# EAGLE design eNode (EAGLE 7.2.0)
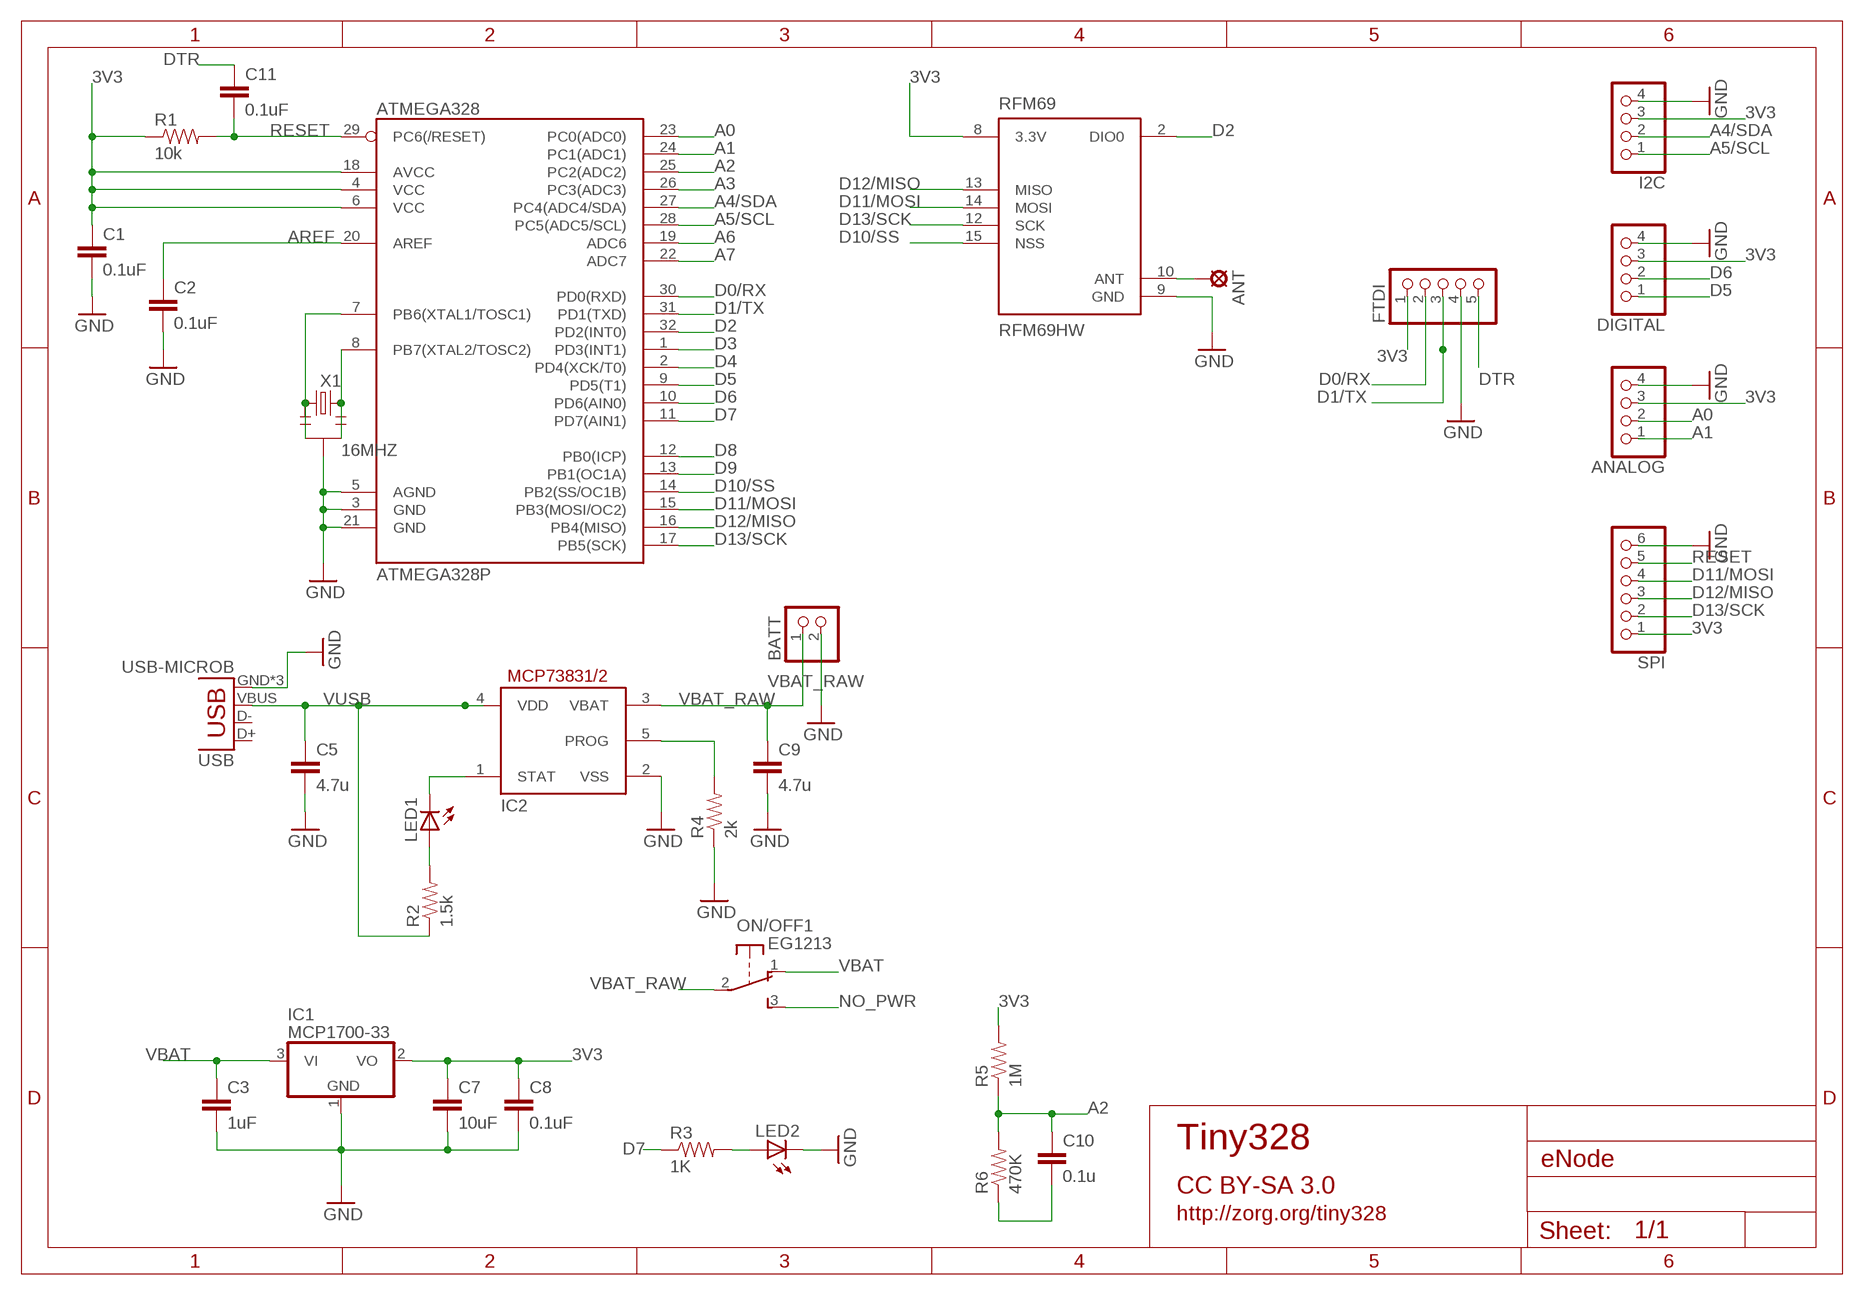
[diagram p0: schematic, sheet 1]

## Parts
ANALOG  PINHD-1X4  [1X04]
ANT  LSP10  [LSP10]
ATMEGA328P  ATMEGA328  ATMEGA168  [TQFP32-08]
BATT  PINHD-1X2  [1X02]
C1  0.1uF  CAP0603-CAP  [0603-CAP]
C2  0.1uF  CAP0603-CAP  [0603-CAP]
C3  1uF  CAP0603-CAP  [0603-CAP]
C5  4.7u  CAP0603-CAP  [0603-CAP]
C7  10uF  CAP0603-CAP  [0603-CAP]
C8  0.1uF  CAP0603-CAP  [0603-CAP]
C9  4.7u  CAP0603-CAP  [0603-CAP]
C10  0.1u  CAP0603-CAP  [0603-CAP]
C11  0.1uF  CAP0603-CAP  [0603-CAP]
DIGITAL  PINHD-1X4  [1X04]
FTDI  PINHD-1X5  [1X05]
I2C  PINHD-1X4  [1X04]
IC1  MCP1700-33  MCP1703CB  [SOT23]
IC2  MCP73831/OT  [SOT23-5L]
LED1  LEDCHIPLED_0603  [CHIPLED_0603]
LED2  LEDCHIPLED_0603  [CHIPLED_0603]
ON/OFF  EG1213  [EG1213]
R1  10k  RESISTOR0603-RES  [0603-RES]
R2  1.5k  RESISTOR0603-RES  [0603-RES]
R3  1K  RESISTOR0603-RES  [0603-RES]
R4  2k  RESISTOR0603-RES  [0603-RES]
R5  1M  RESISTOR0603-RES  [0603-RES]
R6  470K  RESISTOR0603-RES  [0603-RES]
RFM69  RFM69HW  [RFM69W-XXXS2]
SPI  PINHD-1X6  [1X06]
USB  USB-MICROB  [USB-MICROB]
X1  16MHZ  RESONATOR16MHZ  [RESONATOR-SMD]

## Nets
3V3: ANALOG.3 ATMEGA328P.4(VCC) ATMEGA328P.6(VCC) ATMEGA328P.18(AVCC) C1.1 C7.1 C8.1 DIGITAL.3 FTDI.1 I2C.3 IC1.2(VO) R1.1 R5.2 RFM69.8(3.3V) SPI.1
A0: ANALOG.2 ATMEGA328P.23(PC0(ADC0))
A1: ANALOG.1 ATMEGA328P.24(PC1(ADC1))
A2: ATMEGA328P.25(PC2(ADC2)) C10.1 R5.1 R6.2
A3: ATMEGA328P.26(PC3(ADC3))
A4/SDA: ATMEGA328P.27(PC4(ADC4/SDA)) I2C.2
A5/SCL: ATMEGA328P.28(PC5(ADC5/SCL)) I2C.1
A6: ATMEGA328P.19(ADC6)
A7: ATMEGA328P.22(ADC7)
ANT: ANT.MP RFM69.10(ANT)
AREF: ATMEGA328P.20(AREF) C2.1
D0/RX: ATMEGA328P.30(PD0(RXD)) FTDI.2
D1/TX: ATMEGA328P.31(PD1(TXD)) FTDI.3
D2: ATMEGA328P.32(PD2(INT0)) RFM69.2(DIO0)
D3: ATMEGA328P.1(PD3(INT1))
D4: ATMEGA328P.2(PD4(XCK/T0))
D5: ATMEGA328P.9(PD5(T1)) DIGITAL.1
D6: ATMEGA328P.10(PD6(AIN0)) DIGITAL.2
D7: ATMEGA328P.11(PD7(AIN1)) R3.1
D8: ATMEGA328P.12(PB0(ICP))
D9: ATMEGA328P.13(PB1(OC1A))
D10/SS: ATMEGA328P.14(PB2(SS/OC1B)) RFM69.15(NSS)
D11/MOSI: ATMEGA328P.15(PB3(MOSI/OC2)) RFM69.14(MOSI) SPI.4
D12/MISO: ATMEGA328P.16(PB4(MISO)) RFM69.13(MISO) SPI.3
D13/SCK: ATMEGA328P.17(PB5(SCK)) RFM69.12(SCK) SPI.2
DTR: C11.1 FTDI.5
GND: ANALOG.4 ATMEGA328P.3(GND) ATMEGA328P.5(AGND) ATMEGA328P.21(GND) BATT.2 C1.2 C2.2 C3.2 C5.2 C7.2 C8.2 C9.2 DIGITAL.4 FTDI.4 I2C.4 IC1.1(GND) IC2.2(VSS) LED2.C R4.1 RFM69.9(GND) SPI.6 USB.GND USB.MT1(GND) USB.MT2(GND) X1.2
N$1: LED1.A R2.2
N$3: ATMEGA328P.7(PB6(XTAL1/TOSC1)) X1.1
N$4: ATMEGA328P.8(PB7(XTAL2/TOSC2)) X1.3
N$6: C10.2 R6.1
N$8: LED2.A R3.2
NO_PWR: ON/OFF.3(1:S)
PROG: IC2.5(PROG) R4.2
RESET: ATMEGA328P.29(PC6(/RESET)) C11.2 R1.2 SPI.5
STAT: IC2.1(STAT) LED1.C
VBAT: C3.1 IC1.3(VI) ON/OFF.1(1:O)
VBAT_RAW: BATT.1 C9.1 IC2.3(VBAT) ON/OFF.2(1:P)
VUSB: C5.1 IC2.4(VDD) R2.1 USB.VBUS
Unconnected: ON/OFF.MT1(MT) ON/OFF.MT2(MT) USB.D+ USB.D-

## Notes on the sheet
- Tiny328
- CC BY-SA 3.0
- http://zorg.org/tiny328

## Library data of the parts
ANALOG DIGITAL I2C = pinhead:PINHD-1X4: PIN HEADER
ANT = solpad:LSP10: SOLDER PAD drill 1.0 mm, distributor Buerklin, 12H555
ATMEGA328P = SparkFun-DigitalIC:ATMEGA168: Atmel 32-pin 8-bit micro, 16k flash.
BATT = pinhead:PINHD-1X2: PIN HEADER
C1-C3 C5 C7-C11 = SparkFun-Passives:CAP: Capacitor Standard 0603 ceramic capacitor, and 0.1" leaded capacitor.
FTDI = pinhead:PINHD-1X5: PIN HEADER
IC1 = linear:MCP1703: 250 mA, 16V, Low Quiescent Current LDO Regulator Source: http://ww1.microchip.com/downloads/en/DeviceDoc/22049b.pdf
IC2 = adafruit:MCP73831: MCP73831/2 Miniature Single-Cell, Fully Integrated Li-Ion, Li-Polymer Charge Management Controllers. Nice and small simple lipoly charge controller, with adjustable current and status output (LED) http://www.ladyada.net/library/pcb/eaglelibrary.html
LED1 LED2 = adafruit:LED: LED OSRAM: - CHIPLED LG R971, LG N971, LY N971, LG Q971, LY Q971, LO R971, LY R971 LH N974, LH R974 LS Q976, LO Q976, LY Q976 LO Q996 - Hyper CHIPLED LW Q18S LB Q993, LB Q99A, LB R99A - SideLED LS A670, LO A670, LY A670, LG A670, LP A670 LB A673, LV A673, LT A673, LW A673 LH A674 LY A675 LS A676, LA A676, LO A676, LY A676, LW A676 LS A679, LY A679, LG A679 - Hyper Micro SIDELED® LS Y876, LA Y876, LO Y876, LY Y876 LT Y87S - SmartLED LW L88C, LW L88S LB L89C, LB L89S, LG L890 LS L89K, LO L89K, LY L89K LS L896, LA L896, LO L896, LY L896 - TOPLED LS T670, LO T670, LY T670, LG T670, LP T670 LSG T670, LSP T670, LSY T670, LOP T670, LYG T670 LG T671, LOG T671, LSG T671 LB T673, LV T673, LT T673, LW T673 LH T674 LS T676, LA T676, LO T676, LY T676, LB T676, LH T676, LSB T676, LW T676 LB T67C, LV T67C, LT T67C, LS T67K, LO T67K, LY T67K, LW E67C LS E67B, LA E67B, LO E67B, LY E67B, LB E67C, LV E67C, LT E67C LW T67C LS T679, LY T679, LG T679 LS T770, LO T770, LY T770, LG T770, LP T770 LB T773, LV T773, LT T773, LW T773 LH T774 LS E675, LA E675, LY E675, LS T675 LS T776, LA T776, LO T776, LY T776, LB T776 LHGB T686 LT T68C, LB T68C - Hyper Mini TOPLED® LB M676 - Mini TOPLED Santana® LG M470 LS M47K, LO M47K, LY M47K Source: http://www.osram.convergy.de/
ON/OFF = adafruit:EG1213: E-Switch right-angle slide SPDT Part #EG1213 http://www.ladyada.net/library/eagle
R1-R6 = SparkFun-Passives:RESISTOR: Resistor Basic schematic elements and footprints for 0603, 1206, and PTH resistors.
RFM69 = SparkFun-RF:RFM69H
SPI = pinhead:PINHD-1X6: PIN HEADER
USB = SparkFun-Connectors:USB: USB Connectors USB-B-PTH is fully proven SKU : PRT-00139/CONN-08278 USB-miniB is fully proven SKU : PRT-00587 USB-A-PCB is untested. USB-A-H is throughly reviewed, but untested. Spark Fun Electronics SKU : PRT-00437 USB-B-SMT is throughly reviewed, but untested. Needs silkscreen touching up. USB-A-S has not been used/tested USB-MB-H has not been used/tested USB-MICROB has been used. CONN-09505; PROD_ID: CONN-09505
X1 = SparkFun-FreqCtrl:RESONATOR: Resonator Small SMD resonator. Used, eg, on the Arduino Pro/ Pro Mini boards. 8MHz- XTAL-08895 16MHz- XTAL-08900; PROD_ID: XTAL-08900

## Board
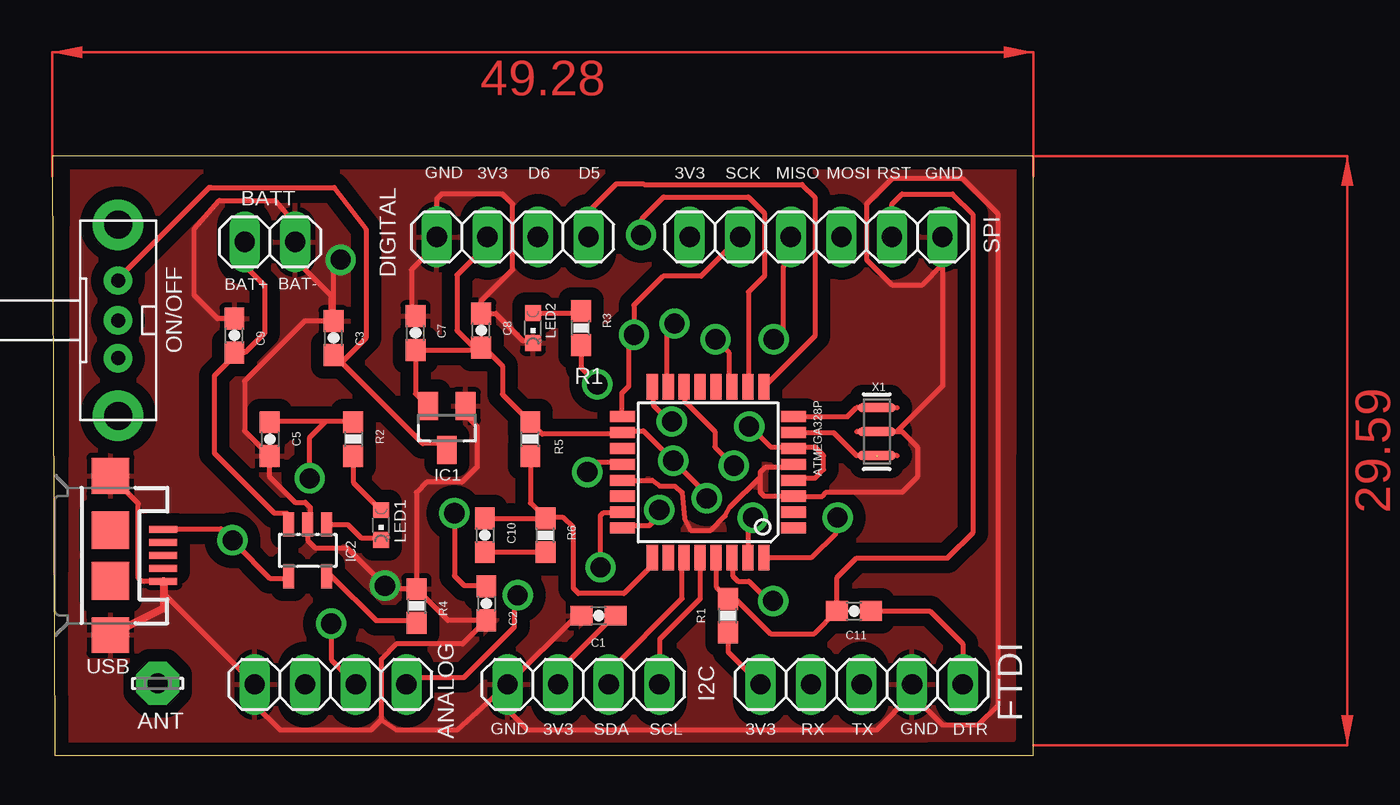
[diagram p1: board, top side]
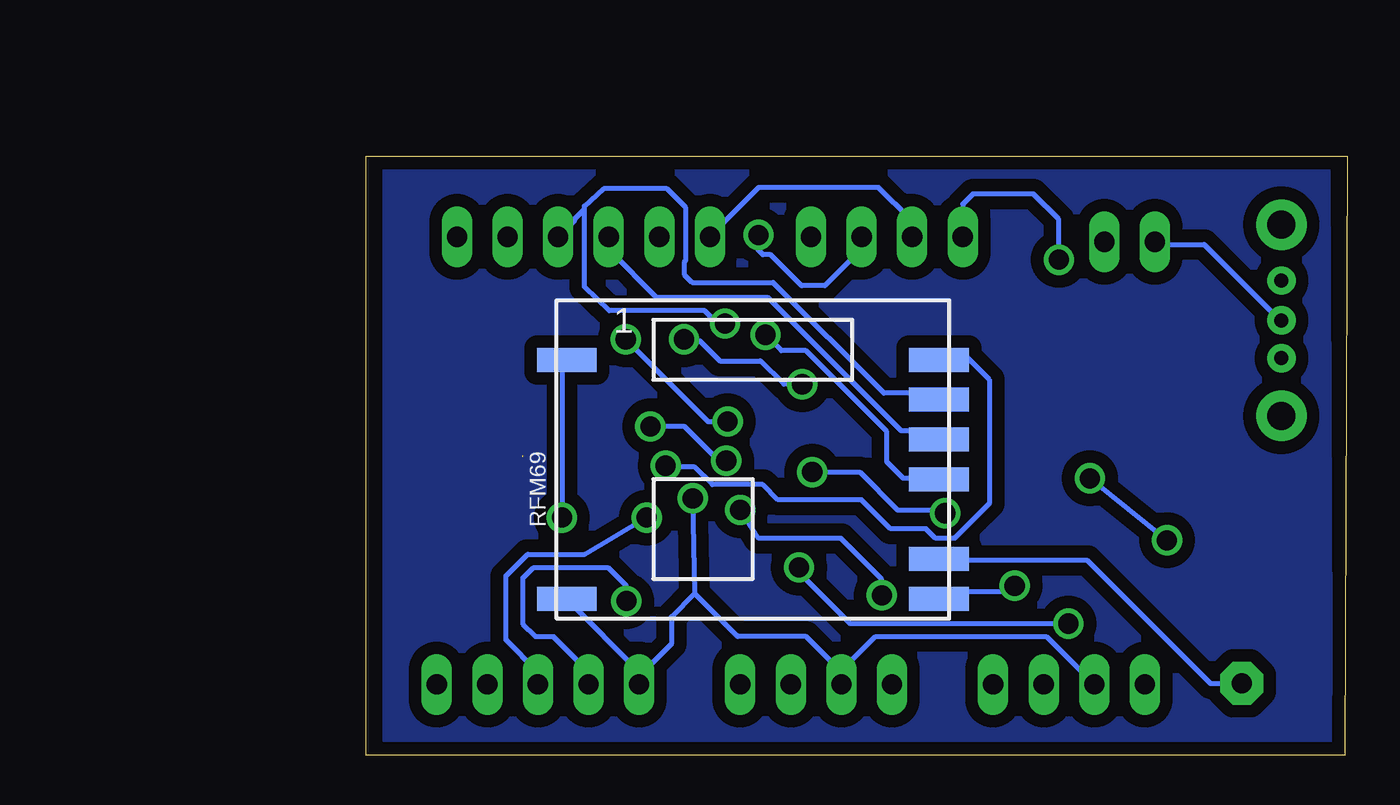
[diagram p2: board, bottom side, seen from below]

Size 49.28 x 30.1 mm. Coordinates in mm from the lower left corner, seen from the top.
Outline: 0.13,0 49.28,0 49.28,30.1 0,30.1 0.13,0
Copper layers (1*16): Top 0.035mm / dielectric 1.5mm / Bottom 0.035mm
Design rules "Fusion_eagle_rule_v1.1 *": minimum track width 10mil, minimum drill 40mil, track to track 11mil, track to pad 11mil, pad to pad 11mil, via to via 11mil, smd to smd 11mil, copper to edge 10mil, drill to drill 10mil, minimum pad ring 10mil, minimum via ring 6mil, stop-mask expansion 2mil, vias tented up to drill 100mil, thermal gap 10mil

### Footprints (pad centres in the part's own frame; a part is rotated, then mirrored left to right if it is on the bottom)
1X04 = drill 1.016 long: 1 -3.81,0; 2 -1.27,0; 3 1.27,0; 4 3.81,0
LSP10 = drill 1.016 pad 2.159 octagon: MP 0,0
TQFP32-08 = smd 1.27 x 0.559: 1 -4.293,2.8; 2 -4.293,2; 3 -4.293,1.2; 4 -4.293,0.4; 5 -4.293,-0.4; 6 -4.293,-1.2; 7 -4.293,-2; 8 -4.293,-2.8; 17 4.293,-2.8; 18 4.293,-2; 19 4.293,-1.2; 20 4.293,-0.4; 21 4.293,0.4; 22 4.293,1.2; 23 4.293,2; 24 4.293,2.8 | smd 0.559 x 1.27: 9 -2.8,-4.293; 10 -2,-4.293; 11 -1.2,-4.293; 12 -0.4,-4.293; 13 0.4,-4.293; 14 1.2,-4.293; 15 2,-4.293; 16 2.8,-4.293; 25 2.8,4.293; 26 2,4.293; 27 1.2,4.293; 28 0.4,4.293; 29 -0.4,4.293; 30 -1.2,4.293; 31 -2,4.293; 32 -2.8,4.293
1X02 = drill 1.016 long: 1 -1.27,0; 2 1.27,0
0603-CAP = smd 1.1 x 1: 1 -0.85,0; 2 0.85,0
1X05 = drill 1.016 long: 1 -5.08,0; 2 -2.54,0; 3 0,0; 4 2.54,0; 5 5.08,0
SOT23 = smd 1 x 1.4: 1 -0.95,-1.1; 2 0.95,-1.1; 3 0,1.1
SOT23-5L = smd 0.55 x 1.2: 1 -0.95,-1.3; 2 0,-1.3; 3 0.95,-1.3; 4 0.95,1.3; 5 -0.95,1.3
CHIPLED_0603 = smd 0.8 x 0.8: A 0,-0.75; C 0,0.75
EG1213 = drill 0.7 pad 1.422: 1 -2,0; 2 0,0; 3 1.9,0 | drill 1.4 pad 2.54: MT1 -4.8,0; MT2 4.8,0
0603-RES = smd 1.1 x 1: 1 -0.85,0; 2 0.85,0
RFM69W-XXXS2 = smd 3 x 1.2: 2 -9.35,5; 8 -9.35,-7; 9 9.35,-7; 10 9.35,-5; 12 9.35,-1; 13 9.35,1; 14 9.35,3; 15 9.35,5
1X06 = drill 1.016 long: 1 -6.35,0; 2 -3.81,0; 3 -1.27,0; 4 1.27,0; 5 3.81,0; 6 6.35,0
USB-MICROB = smd 0.35 x 1.4: D+ 0,2.65; D- -0.65,2.65; GND 1.3,2.65; ID 0.65,2.65; VBUS -1.3,2.65 | smd 1.8 x 1.9: MT1 -4,0; MT2 4,0 | smd 1.9 x 1.9: P$1 -1.27,0; P$2 1.27,0
RESONATOR-SMD = smd 0.45 x 1.905: 1 -1.2,0; 2 0,0; 3 1.2,0

### Placement (x,y rotation side)
ANALOG  13.97,3.56 180 top
ANT  5.28,3.61 0 top
ATMEGA328P  32.93,14.21 180 top
BATT  10.92,25.78 0 top
C1  27.43,7.01 180 top
C2  21.79,7.62 270 top
C3  14.12,20.96 90 top
C5  10.92,15.88 270 top
C7  18.24,21.21 90 top
C8  21.54,21.34 90 top
C9  9.14,21.08 90 top
C10  21.72,11.05 270 top
C11  40.26,7.24 180 top
DIGITAL  23.11,26.04 180 top
FTDI  40.64,3.56 0 top
I2C  26.67,3.56 180 top
IC1  19.81,16.43 180 top
IC2  12.83,10.29 180 top
LED1  16.51,11.56 180 top
LED2  24.13,21.46 180 top
ON/OFF  3.3,21.84 270 top
R1  33.93,7.01 90 top
R2  15.11,15.88 270 top
R3  26.54,21.46 90 top
R4  18.29,7.49 270 top
R5  24,15.88 90 top
R6  24.77,11.05 90 top
RFM69  29.84,14.86 0 bottom
SPI  38.35,26.04 0 top
USB  2.92,10.03 270 top
X1  41.4,16.26 90 top

### Tracks (layer width: path | path; a pad name or v marks a point on that pad's centre or on a via)
3V3  (via drill 1.02)
  Top 0.254: ATMEGA328P.4 37.34,13.91 38.29,13.91 38.73,14.35 38.73,15.05 38.29,15.49 37.34,15.49 ATMEGA328P.6 | 37.18,15.49 ATMEGA328P.6 | 18.92,17.56 IC1.2 18.24,18.16 C7.1 21.41,20.36 | 35.43,3.59 FTDI.1 33.93,5.18 R1.1 | C1.1 28.13,6.92 25.43,4.22 25.43,3.59 I2C.3 | 37.18,15.37 ATMEGA328P.6 | 21.41,20.36 C8.1 21.45,20.57 21.08,20.57 20.32,21.34 20.32,24.13 21.84,25.65 DIGITAL.3 | 21.41,20.36 21.8,20.36 22.61,19.56 22.61,18.12 R5.2 24.6,16.13 28.61,16.13 ATMEGA328P.18 28.77,16.29 29.69,16.29 v31.18,14.8 32.77,13.21 v32.87,12.9 | v34.99,16.51 35.05,16.51 36.07,15.49 37.14,15.49 ATMEGA328P.6
  Bottom 0.254: SPI.1 31.94,26.13 29.56,28.51 23.53,28.51 21.94,26.92 21.94,26.13 DIGITAL.3 | RFM69.8 39.08,7.71 35.59,4.22 35.59,3.59 FTDI.1 | ANALOG.3 15.11,5.97 23.69,5.97 25.27,4.38 25.27,3.59 I2C.3 25.27,4.54 25.75,4.54 27.18,5.97 30.61,5.97 32.77,8.13 | 35.59,4.38 FTDI.1 | v34.99,16.51 33.27,16.51 31.56,14.8 v31.18,14.8 | v32.87,12.9 32.77,8.13 | 32.77,8.13 33.93,6.96 33.93,5.59 35.56,3.96 FTDI.1
A0  (via drill 1.02)
  Top 0.254: 28.61,12.16 ATMEGA328P.23 28.62,12.19 27.69,12.19 27.53,12.03 v27.53,9.43 | 15.11,3.59 ANALOG.2 14,4.79 v14,6.6
  Bottom 0.254: v14,6.6 24.96,6.6 27.53,9.18 v27.53,9.43
A1  (via drill 1.02)
  Top 0.254: v23.37,8.03 23.21,7.87 23.21,6.45 20.67,3.9 17.81,3.9 17.81,3.59 ANALOG.1 | ATMEGA328P.24 28.77,11.52 29.97,11.52 30.48,12.03 v30.48,12.32
  Bottom 0.254: v30.48,12.32 29.56,10.89 25.43,10.89 23.37,8.83 v23.37,8.03
A2
  Top 0.254: C10.1 R6.2 | R5.1 24,12.66 R6.2 | ATMEGA328P.25 30.13,9.56 28.7,8.13 26.42,8.13 26.16,8.38 26.16,11.43 25.65,11.94 24.8,11.94 R6.2
A4/SDA
  Top 0.254: ATMEGA328P.27 31.62,9.78 31.62,7.87 27.97,4.22 27.97,3.59 I2C.2
A5/SCL
  Top 0.254: ATMEGA328P.28 32.54,9.78 32.54,7.87 30.51,5.84 30.51,3.59 I2C.1
ANT
  Bottom 0.254: RFM69.10 20.35,9.78 13.05,9.78 6.86,3.59 5.43,3.59 ANT.MP
AREF  (via drill 1.02)
  Top 0.254: v20.19,12.16 20.19,9.02 20.7,8.51 21.78,8.51 C2.1 | v26.86,14.22 27.34,14.7 28.61,14.7 ATMEGA328P.20
  Bottom 0.254: v20.19,12.16 20.35,12.32 22.57,12.32 24.48,14.22 v26.86,14.22
D0/RX  (via drill 1.02)
  Top 0.254: ATMEGA328P.30 34.16,9.94 34.16,9.02 34.44,8.74 34.98,8.74 35.97,7.75 v36.2,7.75
  Bottom 0.254: FTDI.2 38.13,3.59 38.13,4.22 39.88,5.97 40.77,5.97 41.4,6.6 41.4,8.89 40.89,9.4 37.08,9.4 36.2,8.51 v36.2,7.75
D1/TX  (via drill 1.02)
  Top 0.254: 34.96,9.94 ATMEGA328P.31 | 35.05,9.79 ATMEGA328P.31 | ATMEGA328P.31 34.96,9.94 34.96,11.72 v35.18,11.94
  Bottom 0.254: v35.18,11.94 38.29,10.1 41.15,10.1 42.26,8.98 42.26,5.81 40.67,4.22 40.67,3.59 FTDI.3
D2  (via drill 1.02)
  Top 0.254: ATMEGA328P.32 35.75,9.94 38.13,9.94 39.37,11.18 39.37,11.88 v39.43,11.94 39.42,11.9
  Bottom 0.254: v39.43,11.94 39.43,19.78 39.08,19.78 RFM69.2
D5
  Top 0.254: ATMEGA328P.9 35.75,18.51 38.29,21.05 38.29,28.04 37.66,28.67 29.72,28.67 29.69,28.7 28.32,28.7 26.86,27.24 26.86,26.13 DIGITAL.1
D6  (via drill 1.02)
  Top 0.254: ATMEGA328P.10 34.96,18.51 34.96,23.27 35.75,24.07 35.75,27.24 34.96,28.04 30.7,28.04 29.59,26.92 29.59,26.16 v29.56,26.13
  Bottom 0.254: DIGITAL.2 24.48,25.97 24.48,25.34 26.23,23.59 27.4,23.59 28.96,25.15 29.34,25.15 29.59,25.4 29.59,26.1 v29.56,26.13
D7  (via drill 1.02)
  Top 0.254: 34,18.51 ATMEGA328P.11 34,18.63 34,20.19 v33.31,20.89 | v27.37,18.64 26.54,19.46 R3.1
  Bottom 0.254: v33.31,20.89 33.24,20.83 32.51,20.83 31.5,19.81 29.46,19.81 28.29,18.64 v27.37,18.64
D10/SS  (via drill 1.02)
  Top 0.254: ATMEGA328P.14 31.78,18.35 31.78,17.72 31.81,17.72 33.27,16.26 33.27,15.49 v34.23,14.54
  Bottom 0.254: 20.35,19.78 RFM69.15 20.41,19.94 19.05,19.94 17.97,18.86 17.97,12.64 19.72,10.89 20.67,10.89 21.14,11.37 22.92,11.37 24.38,12.83 28.57,12.83 29.34,13.59 31.88,13.59 32.77,14.48 34.16,14.48 v34.23,14.54
D11/MOSI  (via drill 1.02)
  Top 0.254: 30.83,18.51 ATMEGA328P.15 30.86,18.57 30.86,21.3 v31.24,21.69
  Bottom 0.254: RFM69.14 20.51,17.88 20.83,18.19 23.27,18.19 28.83,23.75 32.89,23.75 33.27,24.13 33.27,24.8 33.21,24.86 33.21,27.5 34.16,28.45 37.34,28.45 38.3,27.58 38.3,27.43 | 38.3,27.43 38.3,23.52 37.05,22.32 37.05,22.33 32.25,22.33 32.26,22.32 31.62,21.69 v31.24,21.69 | 38.3,27.43 38.81,26.92 38.81,26.85 SPI.4
D12/MISO  (via drill 1.02)
  Top 0.254: v36.23,20.89 36.7,21.37 36.7,24.54 37.02,24.86 37.02,25.97 SPI.3 | ATMEGA328P.16 30.19,18.35 30.19,17.56 30.99,16.76 v31.12,16.76
  Bottom 0.254: RFM69.13 20.51,15.97 20.83,16.29 22.38,16.29 29.08,22.99 34.67,22.99 37.02,25.34 37.02,25.97 SPI.3 | v31.12,16.76 32.13,16.76 32.13,16.8 v36.23,20.89
D13/SCK  (via drill 1.02)
  Top 0.254: ATMEGA328P.17 28.61,17.08 28.61,18.19 28.96,18.54 28.96,20.86 v29.21,21.11 29.21,22.61 30.67,24.07 32.57,24.07 SPI.2
  Bottom 0.254: RFM69.12 20.51,13.91 22.29,13.91 23.11,14.73 23.11,16.26 27.18,20.32 28.42,20.32 v29.21,21.11
DTR
  Top 0.254: 40.77,7.24 C11.1 44.07,7.24 45.72,5.59 FTDI.5
GND  (via drill 1.02)
  Top 0.254: 35.56,13.97 35.56,13.21 35.76,13.01 ATMEGA328P.3 38.66,13.01 38.86,13.21 42.67,13.21 43.43,13.97 43.43,15.49 42.67,16.26 42.42,16.26 | 35.56,13.97 35.56,14.22 35.81,14.48 37.09,14.48 ATMEGA328P.5 | ATMEGA328P.21 30.13,13.81 30.51,13.51 31.27,13.51 31.62,13.21 31.75,11.89 32.05,11.3 33.07,11.3 33.78,12.01 34.04,12.47 35.56,13.97 | 16.51,1.78 16.51,4.83 17.27,5.59 20.61,5.59 C2.2 19.86,6.77 R4.1 | 16.51,1.78 17.27,1.27 20.32,1.27 I2C.4 | 16.51,1.78 16,1.27 11.43,1.27 10.16,2.54 ANALOG.4 5.57,8.14 USB.GND 4.47,8.73 4.32,8.89 4.32,12.64 USB.MT1 | C9.2 8.29,21.93 7.11,23.11 7.11,26.42 8.38,27.86 11.18,27.86 12.19,26.67 BATT.2 12.19,24.89 13.97,23.11 13.97,21.96 C3.2 | C3.2 12.66,21.8 9.65,18.8 9.65,16.3 C5.2 10.92,13.97 12.19,12.7 12.7,12.7 12.95,12.45 12.95,11.71 IC2.2 12.83,10.8 13.21,10.41 14.8,10.41 v16.7,8.51 16.87,8.34 R4.1 | C7.2 18.03,22.26 18.03,24.38 19.3,25.65 DIGITAL.4 19.3,27.94 19.56,28.19 22.61,28.19 23.11,27.69 23.11,24.38 21.54,22.81 C8.2 22.26,22.19 23.62,20.83 24.02,20.83 LED2.C | C3.2 14.12,24.54 v14.48,24.89 | 40.39,16.26 42.42,16.26 | SPI.6 44.7,24.64 | 44.7,24.64 44.7,18.54 42.42,16.26 | IC1.1 20.76,17.08 21.34,16.51 21.34,14.48 20.57,13.72 18.8,13.72 18.29,13.21 R4.1 | FTDI.4 43.18,3.05 | 43.18,3.05 44.7,1.52 46.48,1.52 47.5,2.54 47.5,27.18 45.72,28.96 42.16,28.96 40.89,27.69 40.89,24.89 42.16,23.62 43.69,23.62 44.7,24.64 | C1.2 26.31,7.01 I2C.4 | I2C.4 22.86,2.29 23.88,1.27 41.4,1.27 43.18,3.05
  Top 0.406: USB.GND 5.59,8.73 5.59,7.37 USB.MT2
  Bottom 0.254: v16.7,8.51 17.02,8.19 20.03,8.19 20.35,7.87 RFM69.9 | v14.48,24.89 14.48,26.92 15.75,28.19 18.8,28.19 19.3,27.69 DIGITAL.4
  pour Top (isolate 0.635): 1.02,29.46 48.29,29.46 48.26,0.76 0.89,0.51
N$1
  Top 0.254: R2.2 15.11,13.7 LED1.A
N$2
  pour Bottom (isolate 0.635): 1.02,29.46 48.26,29.46 48.26,0.76 0.89,0.51
N$3  (1 unrouted)
  Top 0.254: 40.89,14.99 41.4,14.99 | ATMEGA328P.7 39.23,16.21 40.39,15.06
N$4
  Top 0.254: ATMEGA328P.8 39.94,17.01 40.39,17.46
N$6
  Top 0.254: C10.2 R6.1
N$8
  Top 0.254: LED2.A 26.44,22.21 R3.2
PROG
  Top 0.254: R4.2 18.29,6.76 16.26,6.76 14.03,8.99 IC2.5
RESET
  Top 0.254: SPI.5 42.16,27.69 42.67,28.19 45.21,28.19 46.23,27.18 46.23,11.18 44.96,9.91 40.39,9.91 39.41,8.93 C11.2 38.27,6.1 36.07,6.1 34.3,7.86 R1.2 33.33,8.46 ATMEGA328P.29
STAT
  Top 0.254: LED1.C 16.39,10.92 15.49,10.92 14.83,11.59 IC2.1
VBAT
  Top 0.254: 14.53,19.73 18.61,15.65 19.72,15.65 19.72,15.34 IC1.3 | 14.53,19.73 14.16,20.1 C3.1 | ON/OFF.1 3.37,23.91 3.37,24 7.87,28.51 7.97,28.51 14.16,28.51 15.75,26.42 15.75,20.96 14.53,19.73
VBAT_RAW
  Top 0.254: BATT.1 9.71,25.65 9.71,24.54 10.67,23.59 10.67,21.21 9.71,20.26 9.24,20.26 C9.1 9.24,20.1 9.18,20.1 8.13,19.05 8.13,15.18 11.14,12.16 11.78,12.16 IC2.3
  Bottom 0.254: ON/OFF.2 3.37,21.84 7.18,25.65 9.56,25.65 BATT.1
VUSB  (via drill 1.02)
  Top 0.254: 13.72,16.76 15.11,16.76 R2.1 | 13.72,16.76 10.99,16.76 C5.1 | USB.VBUS 5.59,11.37 8.48,11.37 v9.05,10.8 9.21,10.8 9.21,10.61 10.92,8.89 11.78,8.89 IC2.4 11.78,9.4 | v12.92,13.91 12.92,15.97 13.72,16.76
  Bottom 0.254: v9.05,10.8 v12.92,13.91
(copper drawn outside any net)
  shapes: Top area x2

### Text on the board
tNames: GND | 3V3 | D6 | D5 | 3V3 | SCK | MISO | MOSI | RST | GND | BAT+ | BAT- | GND | GND | 3V3 | SDA | SCL | 3V3 | RX | TX | DTR
tSilk: R1